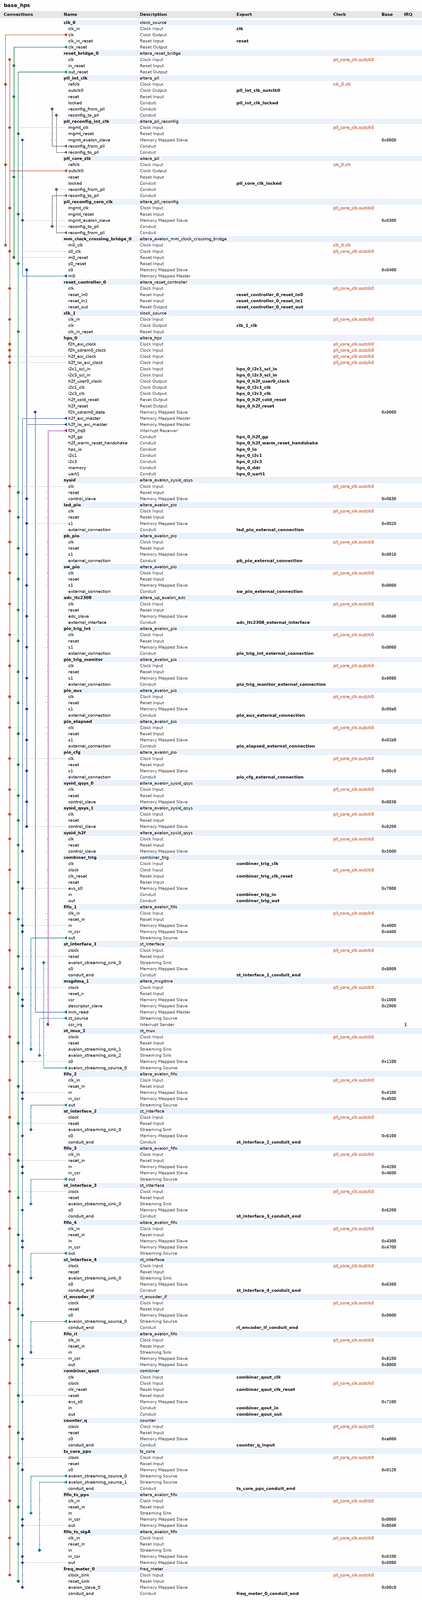
[diagram p0: system contents, whole]
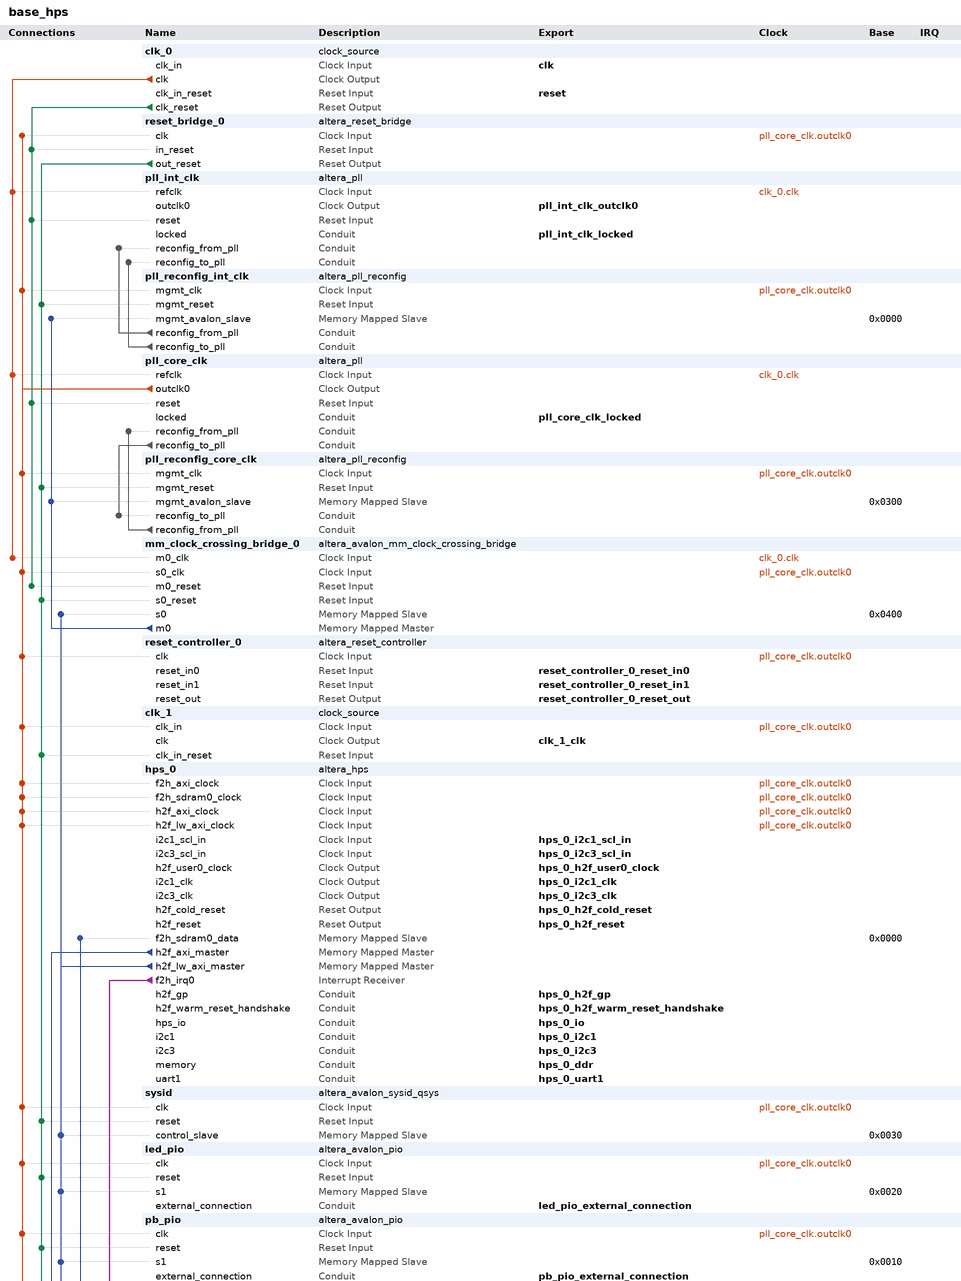
[diagram p1: system contents, upper part]
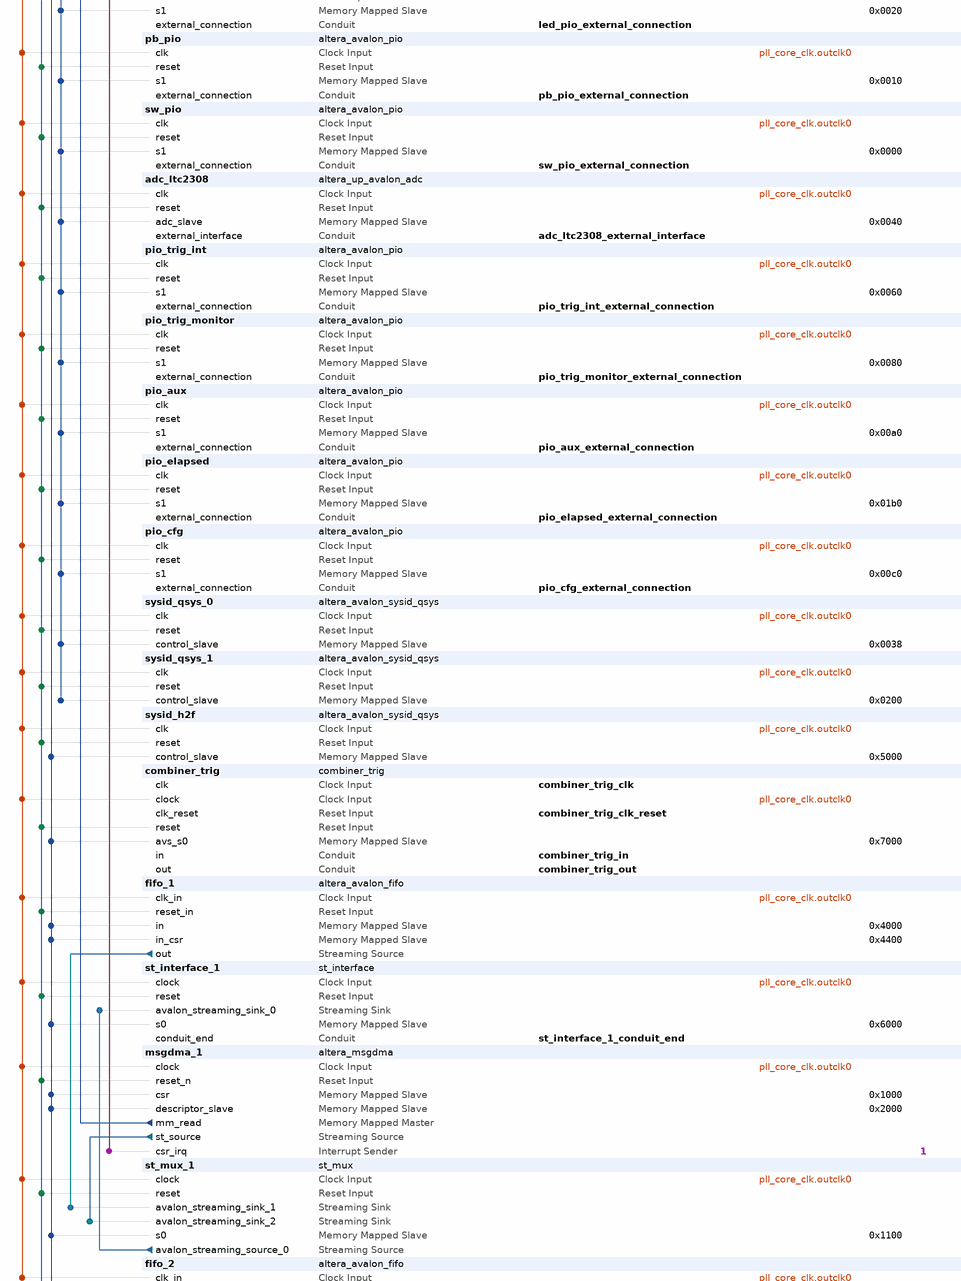
[diagram p2: system contents, middle part]
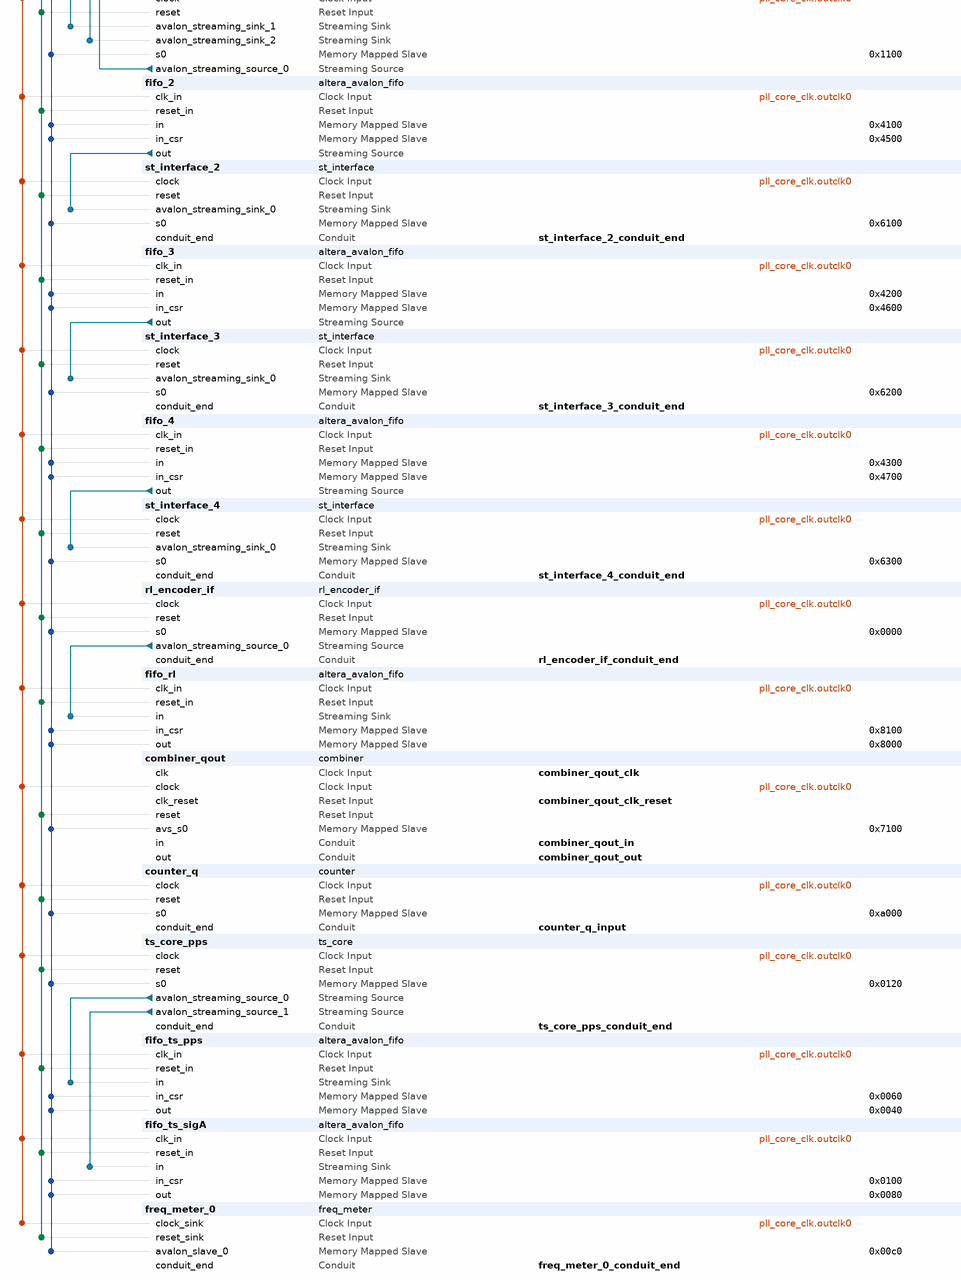
[diagram p3: system contents, lower part]
# Platform Designer (Qsys) system base_hps, Cyclone V 5CSEBA6U23I7
# Parameters at their usual value, and those the tool derives, are not listed.
package require -exact qsys 21.1
create_system base_hps
set_project_property DEVICE_FAMILY {Cyclone V}
set_project_property DEVICE 5CSEBA6U23I7

add_instance clk_0 clock_source 21.1
set_instance_parameter_value clk_0 clockFrequency 50000000

add_instance reset_bridge_0 altera_reset_bridge 21.1
set_instance_parameter_value reset_bridge_0 ACTIVE_LOW_RESET 0
set_instance_parameter_value reset_bridge_0 SYNCHRONOUS_EDGES deassert

add_instance pll_int_clk altera_pll 21.1
set_instance_parameter_value pll_int_clk gui_device_speed_grade 2
set_instance_parameter_value pll_int_clk gui_en_reconf true
set_instance_parameter_value pll_int_clk gui_number_of_clocks 1
set_instance_parameter_value pll_int_clk gui_operation_mode direct
set_instance_parameter_value pll_int_clk gui_output_clock_frequency0 100.0
set_instance_parameter_value pll_int_clk gui_pll_mode {Integer-N PLL}
set_instance_parameter_value pll_int_clk gui_reference_clock_frequency 50.0
set_instance_parameter_value pll_int_clk gui_use_locked true

add_instance pll_reconfig_int_clk altera_pll_reconfig 21.1

add_instance pll_core_clk altera_pll 21.1
set_instance_parameter_value pll_core_clk gui_device_speed_grade 2
set_instance_parameter_value pll_core_clk gui_en_reconf true
set_instance_parameter_value pll_core_clk gui_number_of_clocks 1
set_instance_parameter_value pll_core_clk gui_operation_mode direct
set_instance_parameter_value pll_core_clk gui_output_clock_frequency0 100.0
set_instance_parameter_value pll_core_clk gui_pll_mode {Integer-N PLL}
set_instance_parameter_value pll_core_clk gui_reference_clock_frequency 50.0
set_instance_parameter_value pll_core_clk gui_use_locked true

add_instance pll_reconfig_core_clk altera_pll_reconfig 21.1

add_instance mm_clock_crossing_bridge_0 altera_avalon_mm_clock_crossing_bridge 21.1
set_instance_parameter_value mm_clock_crossing_bridge_0 ADDRESS_WIDTH 10
set_instance_parameter_value mm_clock_crossing_bridge_0 COMMAND_FIFO_DEPTH 4
set_instance_parameter_value mm_clock_crossing_bridge_0 DATA_WIDTH 32
set_instance_parameter_value mm_clock_crossing_bridge_0 MASTER_SYNC_DEPTH 2
set_instance_parameter_value mm_clock_crossing_bridge_0 MAX_BURST_SIZE 1
set_instance_parameter_value mm_clock_crossing_bridge_0 RESPONSE_FIFO_DEPTH 4
set_instance_parameter_value mm_clock_crossing_bridge_0 SLAVE_SYNC_DEPTH 2
set_instance_parameter_value mm_clock_crossing_bridge_0 USE_AUTO_ADDRESS_WIDTH 1

add_instance reset_controller_0 altera_reset_controller 21.1
set_instance_parameter_value reset_controller_0 NUM_RESET_INPUTS 2
set_instance_parameter_value reset_controller_0 SYNC_DEPTH 2

add_instance clk_1 clock_source 21.1
set_instance_parameter_value clk_1 clockFrequency 50000000
set_instance_parameter_value clk_1 clockFrequencyKnown false

add_instance hps_0 altera_hps 21.1
set_instance_parameter_value hps_0 EMAC1_Mode RGMII
set_instance_parameter_value hps_0 EMAC1_PinMuxing {HPS I/O Set 0}
set_instance_parameter_value hps_0 F2SCLK_COLDRST_Enable false
set_instance_parameter_value hps_0 F2SCLK_DBGRST_Enable false
set_instance_parameter_value hps_0 F2SCLK_WARMRST_Enable false
set_instance_parameter_value hps_0 F2SDRAM_Type AXI-3
set_instance_parameter_value hps_0 F2SDRAM_Width 64
set_instance_parameter_value hps_0 F2SINTERRUPT_Enable true
set_instance_parameter_value hps_0 F2S_Width 3
set_instance_parameter_value hps_0 FPGA_PERIPHERAL_OUTPUT_CLOCK_FREQ_EMAC0_GTX_CLK 125
set_instance_parameter_value hps_0 FPGA_PERIPHERAL_OUTPUT_CLOCK_FREQ_EMAC0_MD_CLK 2.5
set_instance_parameter_value hps_0 FPGA_PERIPHERAL_OUTPUT_CLOCK_FREQ_EMAC1_GTX_CLK 125
set_instance_parameter_value hps_0 FPGA_PERIPHERAL_OUTPUT_CLOCK_FREQ_EMAC1_MD_CLK 2.5
set_instance_parameter_value hps_0 GP_Enable true
set_instance_parameter_value hps_0 HPS_PROTOCOL DDR3
set_instance_parameter_value hps_0 I2C0_Mode I2C
set_instance_parameter_value hps_0 I2C0_PinMuxing {HPS I/O Set 0}
set_instance_parameter_value hps_0 I2C1_Mode Full
set_instance_parameter_value hps_0 I2C1_PinMuxing FPGA
set_instance_parameter_value hps_0 I2C3_Mode Full
set_instance_parameter_value hps_0 I2C3_PinMuxing FPGA
set_instance_parameter_value hps_0 LWH2F_Enable true
set_instance_parameter_value hps_0 MEM_BANKADDR_WIDTH 3
set_instance_parameter_value hps_0 MEM_CLK_FREQ 400.0
set_instance_parameter_value hps_0 MEM_COL_ADDR_WIDTH 10
set_instance_parameter_value hps_0 MEM_DQ_WIDTH 32
set_instance_parameter_value hps_0 MEM_DRV_STR RZQ/6
set_instance_parameter_value hps_0 MEM_ROW_ADDR_WIDTH 15
set_instance_parameter_value hps_0 MEM_RTT_NOM RZQ/6
set_instance_parameter_value hps_0 MEM_RTT_WR {Dynamic ODT off}
set_instance_parameter_value hps_0 MEM_TCL 7
set_instance_parameter_value hps_0 MEM_TFAW_NS 45.0
set_instance_parameter_value hps_0 MEM_TRAS_NS 36.0
set_instance_parameter_value hps_0 MEM_TRCD_NS 13.125
set_instance_parameter_value hps_0 MEM_TRFC_NS 300.0
set_instance_parameter_value hps_0 MEM_TRP_NS 13.125
set_instance_parameter_value hps_0 MEM_VENDOR Micron
set_instance_parameter_value hps_0 MEM_WTCL 7
set_instance_parameter_value hps_0 QSPI_Mode N/A
set_instance_parameter_value hps_0 QSPI_PinMuxing Unused
set_instance_parameter_value hps_0 REF_CLK_FREQ 25.0
set_instance_parameter_value hps_0 S2FCLK_COLDRST_Enable true
set_instance_parameter_value hps_0 S2FCLK_PENDINGRST_Enable true
set_instance_parameter_value hps_0 S2FCLK_USER0CLK_Enable true
set_instance_parameter_value hps_0 S2FCLK_USER2CLK 5
set_instance_parameter_value hps_0 S2F_Width 3
set_instance_parameter_value hps_0 SDIO_Mode {4-bit Data}
set_instance_parameter_value hps_0 SDIO_PinMuxing {HPS I/O Set 0}
set_instance_parameter_value hps_0 SPIM1_Mode N/A
set_instance_parameter_value hps_0 SPIM1_PinMuxing Unused
set_instance_parameter_value hps_0 STM_Enable false
set_instance_parameter_value hps_0 TIMING_BOARD_AC_SKEW 0.02
set_instance_parameter_value hps_0 TIMING_BOARD_AC_TO_CK_SKEW 0.01
set_instance_parameter_value hps_0 TIMING_BOARD_DQ_TO_DQS_SKEW 0.05
set_instance_parameter_value hps_0 TIMING_BOARD_MAX_CK_DELAY 0.03
set_instance_parameter_value hps_0 TIMING_BOARD_MAX_DQS_DELAY 0.02
set_instance_parameter_value hps_0 TIMING_BOARD_SKEW_BETWEEN_DQS 0.06
set_instance_parameter_value hps_0 TIMING_BOARD_SKEW_CKDQS_DIMM_MAX 0.12
set_instance_parameter_value hps_0 TIMING_BOARD_SKEW_CKDQS_DIMM_MIN 0.06
set_instance_parameter_value hps_0 TIMING_BOARD_SKEW_WITHIN_DQS 0.01
set_instance_parameter_value hps_0 TIMING_TDH 65
set_instance_parameter_value hps_0 TIMING_TDQSCK 255
set_instance_parameter_value hps_0 TIMING_TDQSQ 125
set_instance_parameter_value hps_0 TIMING_TDS 30
set_instance_parameter_value hps_0 TIMING_TIH 140
set_instance_parameter_value hps_0 TIMING_TIS 190
set_instance_parameter_value hps_0 TIMING_TQSH 0.4
set_instance_parameter_value hps_0 UART0_Mode {No Flow Control}
set_instance_parameter_value hps_0 UART0_PinMuxing {HPS I/O Set 0}
set_instance_parameter_value hps_0 UART1_Mode Full
set_instance_parameter_value hps_0 UART1_PinMuxing FPGA
set_instance_parameter_value hps_0 USB1_Mode SDR
set_instance_parameter_value hps_0 USB1_PinMuxing {HPS I/O Set 0}
set_instance_parameter_value hps_0 desired_cfg_clk_mhz 100.0
set_instance_parameter_value hps_0 desired_qspi_clk_mhz 400.0

add_instance sysid altera_avalon_sysid_qsys 21.1
set_instance_parameter_value sysid id -842982180

add_instance led_pio altera_avalon_pio 21.1
set_instance_parameter_value led_pio direction Output
set_instance_parameter_value led_pio resetValue 85
set_instance_parameter_value led_pio width 8

add_instance pb_pio altera_avalon_pio 21.1
set_instance_parameter_value pb_pio direction Input
set_instance_parameter_value pb_pio width 2

add_instance sw_pio altera_avalon_pio 21.1
set_instance_parameter_value sw_pio direction Input
set_instance_parameter_value sw_pio width 4

add_instance adc_ltc2308 altera_up_avalon_adc 18.0
set_instance_parameter_value adc_ltc2308 board DE10-Nano
set_instance_parameter_value adc_ltc2308 numch_ 8

add_instance pio_trig_int altera_avalon_pio 21.1
set_instance_parameter_value pio_trig_int bitModifyingOutReg true
set_instance_parameter_value pio_trig_int direction Output
set_instance_parameter_value pio_trig_int width 11

add_instance pio_trig_monitor altera_avalon_pio 21.1
set_instance_parameter_value pio_trig_monitor bitClearingEdgeCapReg true
set_instance_parameter_value pio_trig_monitor bitModifyingOutReg true
set_instance_parameter_value pio_trig_monitor direction Input
set_instance_parameter_value pio_trig_monitor width 32

add_instance pio_aux altera_avalon_pio 21.1
set_instance_parameter_value pio_aux bitModifyingOutReg true
set_instance_parameter_value pio_aux direction InOut
set_instance_parameter_value pio_aux width 8

add_instance pio_elapsed altera_avalon_pio 21.1
set_instance_parameter_value pio_elapsed direction Input
set_instance_parameter_value pio_elapsed width 32

add_instance pio_cfg altera_avalon_pio 21.1
set_instance_parameter_value pio_cfg bitModifyingOutReg true
set_instance_parameter_value pio_cfg direction Output
set_instance_parameter_value pio_cfg width 21

add_instance sysid_qsys_0 altera_avalon_sysid_qsys 21.1
set_instance_parameter_value sysid_qsys_0 id 35

add_instance sysid_qsys_1 altera_avalon_sysid_qsys 21.1
set_instance_parameter_value sysid_qsys_1 id 6

add_instance sysid_h2f altera_avalon_sysid_qsys 21.1
set_instance_parameter_value sysid_h2f id 305441741

add_instance combiner_trig combiner_trig 1.0

add_instance fifo_1 altera_avalon_fifo 21.1
set_instance_parameter_value fifo_1 bitsPerSymbol 8
set_instance_parameter_value fifo_1 channelWidth 0
set_instance_parameter_value fifo_1 errorWidth 0
set_instance_parameter_value fifo_1 fifoDepth 1024
set_instance_parameter_value fifo_1 fifoInputInterfaceOptions AVALONMM_WRITE
set_instance_parameter_value fifo_1 fifoOutputInterfaceOptions AVALONST_SOURCE
set_instance_parameter_value fifo_1 singleClockMode true
set_instance_parameter_value fifo_1 symbolsPerBeat 4
set_instance_parameter_value fifo_1 useIRQ false
set_instance_parameter_value fifo_1 usePacket false
set_instance_parameter_value fifo_1 useReadControl false

add_instance st_interface_1 st_interface 1.0

add_instance msgdma_1 altera_msgdma 21.1
set_instance_parameter_value msgdma_1 BURST_ENABLE 1
set_instance_parameter_value msgdma_1 BURST_WRAPPING_SUPPORT 1
set_instance_parameter_value msgdma_1 DATA_FIFO_DEPTH 1024
set_instance_parameter_value msgdma_1 DATA_WIDTH 32
set_instance_parameter_value msgdma_1 DESCRIPTOR_FIFO_DEPTH 32
set_instance_parameter_value msgdma_1 ENHANCED_FEATURES 0
set_instance_parameter_value msgdma_1 ERROR_ENABLE 0
set_instance_parameter_value msgdma_1 MAX_BURST_COUNT 256
set_instance_parameter_value msgdma_1 MAX_BYTE 536870912
set_instance_parameter_value msgdma_1 MODE 1
set_instance_parameter_value msgdma_1 PACKET_ENABLE 0
set_instance_parameter_value msgdma_1 TRANSFER_TYPE {Full Word Accesses Only}
set_instance_parameter_value msgdma_1 USE_FIX_ADDRESS_WIDTH 1

add_instance st_mux_1 st_mux 1.0

add_instance fifo_2 altera_avalon_fifo 21.1
set_instance_parameter_value fifo_2 bitsPerSymbol 8
set_instance_parameter_value fifo_2 channelWidth 0
set_instance_parameter_value fifo_2 errorWidth 0
set_instance_parameter_value fifo_2 fifoDepth 1024
set_instance_parameter_value fifo_2 fifoInputInterfaceOptions AVALONMM_WRITE
set_instance_parameter_value fifo_2 fifoOutputInterfaceOptions AVALONST_SOURCE
set_instance_parameter_value fifo_2 singleClockMode true
set_instance_parameter_value fifo_2 symbolsPerBeat 4
set_instance_parameter_value fifo_2 useIRQ false
set_instance_parameter_value fifo_2 usePacket false
set_instance_parameter_value fifo_2 useReadControl false

add_instance st_interface_2 st_interface 1.0

add_instance fifo_3 altera_avalon_fifo 21.1
set_instance_parameter_value fifo_3 bitsPerSymbol 8
set_instance_parameter_value fifo_3 channelWidth 0
set_instance_parameter_value fifo_3 errorWidth 0
set_instance_parameter_value fifo_3 fifoDepth 1024
set_instance_parameter_value fifo_3 fifoInputInterfaceOptions AVALONMM_WRITE
set_instance_parameter_value fifo_3 fifoOutputInterfaceOptions AVALONST_SOURCE
set_instance_parameter_value fifo_3 singleClockMode true
set_instance_parameter_value fifo_3 symbolsPerBeat 4
set_instance_parameter_value fifo_3 useIRQ false
set_instance_parameter_value fifo_3 usePacket false
set_instance_parameter_value fifo_3 useReadControl false

add_instance st_interface_3 st_interface 1.0

add_instance fifo_4 altera_avalon_fifo 21.1
set_instance_parameter_value fifo_4 bitsPerSymbol 8
set_instance_parameter_value fifo_4 channelWidth 0
set_instance_parameter_value fifo_4 errorWidth 0
set_instance_parameter_value fifo_4 fifoDepth 1024
set_instance_parameter_value fifo_4 fifoInputInterfaceOptions AVALONMM_WRITE
set_instance_parameter_value fifo_4 fifoOutputInterfaceOptions AVALONST_SOURCE
set_instance_parameter_value fifo_4 singleClockMode true
set_instance_parameter_value fifo_4 symbolsPerBeat 4
set_instance_parameter_value fifo_4 useIRQ false
set_instance_parameter_value fifo_4 usePacket false
set_instance_parameter_value fifo_4 useReadControl false

add_instance st_interface_4 st_interface 1.0

add_instance rl_encoder_if rl_encoder_if 1.0

add_instance fifo_rl altera_avalon_fifo 21.1
set_instance_parameter_value fifo_rl bitsPerSymbol 32
set_instance_parameter_value fifo_rl channelWidth 0
set_instance_parameter_value fifo_rl errorWidth 0
set_instance_parameter_value fifo_rl fifoDepth 1024
set_instance_parameter_value fifo_rl fifoInputInterfaceOptions AVALONST_SINK
set_instance_parameter_value fifo_rl fifoOutputInterfaceOptions AVALONMM_READ
set_instance_parameter_value fifo_rl singleClockMode true
set_instance_parameter_value fifo_rl symbolsPerBeat 1
set_instance_parameter_value fifo_rl useIRQ false
set_instance_parameter_value fifo_rl usePacket false
set_instance_parameter_value fifo_rl useReadControl false

add_instance combiner_qout combiner 1.0

add_instance counter_q counter 1.0
set_instance_parameter_value counter_q width_addr 8
set_instance_parameter_value counter_q width_bus 32
set_instance_parameter_value counter_q width_data 32

add_instance ts_core_pps ts_core 1.0
set_instance_parameter_value ts_core_pps CTR_W 64

add_instance fifo_ts_pps altera_avalon_fifo 21.1
set_instance_parameter_value fifo_ts_pps bitsPerSymbol 32
set_instance_parameter_value fifo_ts_pps channelWidth 0
set_instance_parameter_value fifo_ts_pps errorWidth 0
set_instance_parameter_value fifo_ts_pps fifoDepth 16
set_instance_parameter_value fifo_ts_pps fifoInputInterfaceOptions AVALONST_SINK
set_instance_parameter_value fifo_ts_pps fifoOutputInterfaceOptions AVALONMM_READ
set_instance_parameter_value fifo_ts_pps singleClockMode true
set_instance_parameter_value fifo_ts_pps symbolsPerBeat 1
set_instance_parameter_value fifo_ts_pps useIRQ false
set_instance_parameter_value fifo_ts_pps usePacket false
set_instance_parameter_value fifo_ts_pps useReadControl false

add_instance fifo_ts_sigA altera_avalon_fifo 21.1
set_instance_parameter_value fifo_ts_sigA bitsPerSymbol 32
set_instance_parameter_value fifo_ts_sigA channelWidth 0
set_instance_parameter_value fifo_ts_sigA errorWidth 0
set_instance_parameter_value fifo_ts_sigA fifoDepth 16
set_instance_parameter_value fifo_ts_sigA fifoInputInterfaceOptions AVALONST_SINK
set_instance_parameter_value fifo_ts_sigA fifoOutputInterfaceOptions AVALONMM_READ
set_instance_parameter_value fifo_ts_sigA singleClockMode true
set_instance_parameter_value fifo_ts_sigA symbolsPerBeat 1
set_instance_parameter_value fifo_ts_sigA useIRQ false
set_instance_parameter_value fifo_ts_sigA usePacket false
set_instance_parameter_value fifo_ts_sigA useReadControl false

add_instance freq_meter_0 freq_meter 1.0

# connections
add_connection clk_0.clk mm_clock_crossing_bridge_0.m0_clk clock
add_connection clk_0.clk pll_core_clk.refclk clock
add_connection clk_0.clk pll_int_clk.refclk clock
add_connection pll_core_clk.outclk0 adc_ltc2308.clk clock
add_connection pll_core_clk.outclk0 clk_1.clk_in clock
add_connection pll_core_clk.outclk0 combiner_qout.clock clock
add_connection pll_core_clk.outclk0 combiner_trig.clock clock
add_connection pll_core_clk.outclk0 counter_q.clock clock
add_connection pll_core_clk.outclk0 fifo_1.clk_in clock
add_connection pll_core_clk.outclk0 fifo_2.clk_in clock
add_connection pll_core_clk.outclk0 fifo_3.clk_in clock
add_connection pll_core_clk.outclk0 fifo_4.clk_in clock
add_connection pll_core_clk.outclk0 fifo_rl.clk_in clock
add_connection pll_core_clk.outclk0 fifo_ts_pps.clk_in clock
add_connection pll_core_clk.outclk0 fifo_ts_sigA.clk_in clock
add_connection pll_core_clk.outclk0 freq_meter_0.clock_sink clock
add_connection pll_core_clk.outclk0 hps_0.f2h_axi_clock clock
add_connection pll_core_clk.outclk0 hps_0.f2h_sdram0_clock clock
add_connection pll_core_clk.outclk0 hps_0.h2f_axi_clock clock
add_connection pll_core_clk.outclk0 hps_0.h2f_lw_axi_clock clock
add_connection pll_core_clk.outclk0 led_pio.clk clock
add_connection pll_core_clk.outclk0 mm_clock_crossing_bridge_0.s0_clk clock
add_connection pll_core_clk.outclk0 msgdma_1.clock clock
add_connection pll_core_clk.outclk0 pb_pio.clk clock
add_connection pll_core_clk.outclk0 pio_aux.clk clock
add_connection pll_core_clk.outclk0 pio_cfg.clk clock
add_connection pll_core_clk.outclk0 pio_elapsed.clk clock
add_connection pll_core_clk.outclk0 pio_trig_int.clk clock
add_connection pll_core_clk.outclk0 pio_trig_monitor.clk clock
add_connection pll_core_clk.outclk0 pll_reconfig_core_clk.mgmt_clk clock
add_connection pll_core_clk.outclk0 pll_reconfig_int_clk.mgmt_clk clock
add_connection pll_core_clk.outclk0 reset_bridge_0.clk clock
add_connection pll_core_clk.outclk0 reset_controller_0.clk clock
add_connection pll_core_clk.outclk0 rl_encoder_if.clock clock
add_connection pll_core_clk.outclk0 st_interface_1.clock clock
add_connection pll_core_clk.outclk0 st_interface_2.clock clock
add_connection pll_core_clk.outclk0 st_interface_3.clock clock
add_connection pll_core_clk.outclk0 st_interface_4.clock clock
add_connection pll_core_clk.outclk0 st_mux_1.clock clock
add_connection pll_core_clk.outclk0 sw_pio.clk clock
add_connection pll_core_clk.outclk0 sysid.clk clock
add_connection pll_core_clk.outclk0 sysid_h2f.clk clock
add_connection pll_core_clk.outclk0 sysid_qsys_0.clk clock
add_connection pll_core_clk.outclk0 sysid_qsys_1.clk clock
add_connection pll_core_clk.outclk0 ts_core_pps.clock clock
add_connection clk_0.clk_reset mm_clock_crossing_bridge_0.m0_reset reset
add_connection clk_0.clk_reset pll_core_clk.reset reset
add_connection clk_0.clk_reset pll_int_clk.reset reset
add_connection clk_0.clk_reset reset_bridge_0.in_reset reset
add_connection reset_bridge_0.out_reset adc_ltc2308.reset reset
add_connection reset_bridge_0.out_reset clk_1.clk_in_reset reset
add_connection reset_bridge_0.out_reset combiner_qout.reset reset
add_connection reset_bridge_0.out_reset combiner_trig.reset reset
add_connection reset_bridge_0.out_reset counter_q.reset reset
add_connection reset_bridge_0.out_reset fifo_1.reset_in reset
add_connection reset_bridge_0.out_reset fifo_2.reset_in reset
add_connection reset_bridge_0.out_reset fifo_3.reset_in reset
add_connection reset_bridge_0.out_reset fifo_4.reset_in reset
add_connection reset_bridge_0.out_reset fifo_rl.reset_in reset
add_connection reset_bridge_0.out_reset fifo_ts_pps.reset_in reset
add_connection reset_bridge_0.out_reset fifo_ts_sigA.reset_in reset
add_connection reset_bridge_0.out_reset freq_meter_0.reset_sink reset
add_connection reset_bridge_0.out_reset led_pio.reset reset
add_connection reset_bridge_0.out_reset mm_clock_crossing_bridge_0.s0_reset reset
add_connection reset_bridge_0.out_reset msgdma_1.reset_n reset
add_connection reset_bridge_0.out_reset pb_pio.reset reset
add_connection reset_bridge_0.out_reset pio_aux.reset reset
add_connection reset_bridge_0.out_reset pio_cfg.reset reset
add_connection reset_bridge_0.out_reset pio_elapsed.reset reset
add_connection reset_bridge_0.out_reset pio_trig_int.reset reset
add_connection reset_bridge_0.out_reset pio_trig_monitor.reset reset
add_connection reset_bridge_0.out_reset pll_reconfig_core_clk.mgmt_reset reset
add_connection reset_bridge_0.out_reset pll_reconfig_int_clk.mgmt_reset reset
add_connection reset_bridge_0.out_reset rl_encoder_if.reset reset
add_connection reset_bridge_0.out_reset st_interface_1.reset reset
add_connection reset_bridge_0.out_reset st_interface_2.reset reset
add_connection reset_bridge_0.out_reset st_interface_3.reset reset
add_connection reset_bridge_0.out_reset st_interface_4.reset reset
add_connection reset_bridge_0.out_reset st_mux_1.reset reset
add_connection reset_bridge_0.out_reset sw_pio.reset reset
add_connection reset_bridge_0.out_reset sysid.reset reset
add_connection reset_bridge_0.out_reset sysid_h2f.reset reset
add_connection reset_bridge_0.out_reset sysid_qsys_0.reset reset
add_connection reset_bridge_0.out_reset sysid_qsys_1.reset reset
add_connection reset_bridge_0.out_reset ts_core_pps.reset reset
add_connection hps_0.h2f_axi_master combiner_qout.avs_s0 avalon
set_connection_parameter_value hps_0.h2f_axi_master/combiner_qout.avs_s0 baseAddress 0x7100
add_connection hps_0.h2f_axi_master combiner_trig.avs_s0 avalon
set_connection_parameter_value hps_0.h2f_axi_master/combiner_trig.avs_s0 baseAddress 0x7000
add_connection hps_0.h2f_axi_master counter_q.s0 avalon
set_connection_parameter_value hps_0.h2f_axi_master/counter_q.s0 baseAddress 0xa000
add_connection hps_0.h2f_axi_master fifo_1.in avalon
set_connection_parameter_value hps_0.h2f_axi_master/fifo_1.in baseAddress 0x4000
add_connection hps_0.h2f_axi_master fifo_1.in_csr avalon
set_connection_parameter_value hps_0.h2f_axi_master/fifo_1.in_csr baseAddress 0x4400
add_connection hps_0.h2f_axi_master fifo_2.in avalon
set_connection_parameter_value hps_0.h2f_axi_master/fifo_2.in baseAddress 0x4100
add_connection hps_0.h2f_axi_master fifo_2.in_csr avalon
set_connection_parameter_value hps_0.h2f_axi_master/fifo_2.in_csr baseAddress 0x4500
add_connection hps_0.h2f_axi_master fifo_3.in avalon
set_connection_parameter_value hps_0.h2f_axi_master/fifo_3.in baseAddress 0x4200
add_connection hps_0.h2f_axi_master fifo_3.in_csr avalon
set_connection_parameter_value hps_0.h2f_axi_master/fifo_3.in_csr baseAddress 0x4600
add_connection hps_0.h2f_axi_master fifo_4.in avalon
set_connection_parameter_value hps_0.h2f_axi_master/fifo_4.in baseAddress 0x4300
add_connection hps_0.h2f_axi_master fifo_4.in_csr avalon
set_connection_parameter_value hps_0.h2f_axi_master/fifo_4.in_csr baseAddress 0x4700
add_connection hps_0.h2f_axi_master fifo_rl.in_csr avalon
set_connection_parameter_value hps_0.h2f_axi_master/fifo_rl.in_csr baseAddress 0x8100
add_connection hps_0.h2f_axi_master fifo_rl.out avalon
set_connection_parameter_value hps_0.h2f_axi_master/fifo_rl.out baseAddress 0x8000
add_connection hps_0.h2f_axi_master fifo_ts_pps.in_csr avalon
set_connection_parameter_value hps_0.h2f_axi_master/fifo_ts_pps.in_csr baseAddress 0x0060
add_connection hps_0.h2f_axi_master fifo_ts_pps.out avalon
set_connection_parameter_value hps_0.h2f_axi_master/fifo_ts_pps.out baseAddress 0x0040
add_connection hps_0.h2f_axi_master fifo_ts_sigA.in_csr avalon
set_connection_parameter_value hps_0.h2f_axi_master/fifo_ts_sigA.in_csr baseAddress 0x0100
add_connection hps_0.h2f_axi_master fifo_ts_sigA.out avalon
set_connection_parameter_value hps_0.h2f_axi_master/fifo_ts_sigA.out baseAddress 0x0080
add_connection hps_0.h2f_axi_master freq_meter_0.avalon_slave_0 avalon
set_connection_parameter_value hps_0.h2f_axi_master/freq_meter_0.avalon_slave_0 baseAddress 0x00c0
add_connection hps_0.h2f_axi_master msgdma_1.csr avalon
set_connection_parameter_value hps_0.h2f_axi_master/msgdma_1.csr baseAddress 0x1000
add_connection hps_0.h2f_axi_master msgdma_1.descriptor_slave avalon
set_connection_parameter_value hps_0.h2f_axi_master/msgdma_1.descriptor_slave baseAddress 0x2000
add_connection hps_0.h2f_axi_master rl_encoder_if.s0 avalon
set_connection_parameter_value hps_0.h2f_axi_master/rl_encoder_if.s0 baseAddress 0x0000
add_connection hps_0.h2f_axi_master st_interface_1.s0 avalon
set_connection_parameter_value hps_0.h2f_axi_master/st_interface_1.s0 baseAddress 0x6000
add_connection hps_0.h2f_axi_master st_interface_2.s0 avalon
set_connection_parameter_value hps_0.h2f_axi_master/st_interface_2.s0 baseAddress 0x6100
add_connection hps_0.h2f_axi_master st_interface_3.s0 avalon
set_connection_parameter_value hps_0.h2f_axi_master/st_interface_3.s0 baseAddress 0x6200
add_connection hps_0.h2f_axi_master st_interface_4.s0 avalon
set_connection_parameter_value hps_0.h2f_axi_master/st_interface_4.s0 baseAddress 0x6300
add_connection hps_0.h2f_axi_master st_mux_1.s0 avalon
set_connection_parameter_value hps_0.h2f_axi_master/st_mux_1.s0 baseAddress 0x1100
add_connection hps_0.h2f_axi_master sysid_h2f.control_slave avalon
set_connection_parameter_value hps_0.h2f_axi_master/sysid_h2f.control_slave baseAddress 0x5000
add_connection hps_0.h2f_axi_master ts_core_pps.s0 avalon
set_connection_parameter_value hps_0.h2f_axi_master/ts_core_pps.s0 baseAddress 0x0120
add_connection hps_0.h2f_lw_axi_master adc_ltc2308.adc_slave avalon
set_connection_parameter_value hps_0.h2f_lw_axi_master/adc_ltc2308.adc_slave baseAddress 0x0040
add_connection hps_0.h2f_lw_axi_master led_pio.s1 avalon
set_connection_parameter_value hps_0.h2f_lw_axi_master/led_pio.s1 baseAddress 0x0020
add_connection hps_0.h2f_lw_axi_master mm_clock_crossing_bridge_0.s0 avalon
set_connection_parameter_value hps_0.h2f_lw_axi_master/mm_clock_crossing_bridge_0.s0 baseAddress 0x0400
add_connection hps_0.h2f_lw_axi_master pb_pio.s1 avalon
set_connection_parameter_value hps_0.h2f_lw_axi_master/pb_pio.s1 baseAddress 0x0010
add_connection hps_0.h2f_lw_axi_master pio_aux.s1 avalon
set_connection_parameter_value hps_0.h2f_lw_axi_master/pio_aux.s1 baseAddress 0x00a0
add_connection hps_0.h2f_lw_axi_master pio_cfg.s1 avalon
set_connection_parameter_value hps_0.h2f_lw_axi_master/pio_cfg.s1 baseAddress 0x00c0
add_connection hps_0.h2f_lw_axi_master pio_elapsed.s1 avalon
set_connection_parameter_value hps_0.h2f_lw_axi_master/pio_elapsed.s1 baseAddress 0x01b0
add_connection hps_0.h2f_lw_axi_master pio_trig_int.s1 avalon
set_connection_parameter_value hps_0.h2f_lw_axi_master/pio_trig_int.s1 baseAddress 0x0060
add_connection hps_0.h2f_lw_axi_master pio_trig_monitor.s1 avalon
set_connection_parameter_value hps_0.h2f_lw_axi_master/pio_trig_monitor.s1 baseAddress 0x0080
add_connection hps_0.h2f_lw_axi_master sw_pio.s1 avalon
set_connection_parameter_value hps_0.h2f_lw_axi_master/sw_pio.s1 baseAddress 0x0000
add_connection hps_0.h2f_lw_axi_master sysid.control_slave avalon
set_connection_parameter_value hps_0.h2f_lw_axi_master/sysid.control_slave baseAddress 0x0030
add_connection hps_0.h2f_lw_axi_master sysid_qsys_0.control_slave avalon
set_connection_parameter_value hps_0.h2f_lw_axi_master/sysid_qsys_0.control_slave baseAddress 0x0038
add_connection hps_0.h2f_lw_axi_master sysid_qsys_1.control_slave avalon
set_connection_parameter_value hps_0.h2f_lw_axi_master/sysid_qsys_1.control_slave baseAddress 0x0200
add_connection mm_clock_crossing_bridge_0.m0 pll_reconfig_core_clk.mgmt_avalon_slave avalon
set_connection_parameter_value mm_clock_crossing_bridge_0.m0/pll_reconfig_core_clk.mgmt_avalon_slave baseAddress 0x0300
add_connection mm_clock_crossing_bridge_0.m0 pll_reconfig_int_clk.mgmt_avalon_slave avalon
set_connection_parameter_value mm_clock_crossing_bridge_0.m0/pll_reconfig_int_clk.mgmt_avalon_slave baseAddress 0x0000
add_connection msgdma_1.mm_read hps_0.f2h_sdram0_data avalon
set_connection_parameter_value msgdma_1.mm_read/hps_0.f2h_sdram0_data baseAddress 0x0000
add_connection fifo_1.out st_mux_1.avalon_streaming_sink_1 avalon_streaming
add_connection fifo_2.out st_interface_2.avalon_streaming_sink_0 avalon_streaming
add_connection fifo_3.out st_interface_3.avalon_streaming_sink_0 avalon_streaming
add_connection fifo_4.out st_interface_4.avalon_streaming_sink_0 avalon_streaming
add_connection msgdma_1.st_source st_mux_1.avalon_streaming_sink_2 avalon_streaming
add_connection rl_encoder_if.avalon_streaming_source_0 fifo_rl.in avalon_streaming
add_connection st_mux_1.avalon_streaming_source_0 st_interface_1.avalon_streaming_sink_0 avalon_streaming
add_connection ts_core_pps.avalon_streaming_source_0 fifo_ts_pps.in avalon_streaming
add_connection ts_core_pps.avalon_streaming_source_1 fifo_ts_sigA.in avalon_streaming
add_connection pll_core_clk.reconfig_to_pll pll_reconfig_core_clk.reconfig_to_pll conduit
add_connection pll_reconfig_core_clk.reconfig_from_pll pll_core_clk.reconfig_from_pll conduit
add_connection pll_reconfig_int_clk.reconfig_from_pll pll_int_clk.reconfig_from_pll conduit
add_connection pll_reconfig_int_clk.reconfig_to_pll pll_int_clk.reconfig_to_pll conduit
add_connection hps_0.f2h_irq0 msgdma_1.csr_irq interrupt
set_connection_parameter_value hps_0.f2h_irq0/msgdma_1.csr_irq irqNumber 1

# exported interfaces
add_interface adc_ltc2308_external_interface conduit end
set_interface_property adc_ltc2308_external_interface EXPORT_OF adc_ltc2308.external_interface
add_interface clk clock sink
set_interface_property clk EXPORT_OF clk_0.clk_in
add_interface clk_1_clk clock source
set_interface_property clk_1_clk EXPORT_OF clk_1.clk
add_interface combiner_qout_clk clock sink
set_interface_property combiner_qout_clk EXPORT_OF combiner_qout.clk
add_interface combiner_qout_clk_reset reset sink
set_interface_property combiner_qout_clk_reset EXPORT_OF combiner_qout.clk_reset
add_interface combiner_qout_in conduit end
set_interface_property combiner_qout_in EXPORT_OF combiner_qout.in
add_interface combiner_qout_out conduit end
set_interface_property combiner_qout_out EXPORT_OF combiner_qout.out
add_interface combiner_trig_clk clock sink
set_interface_property combiner_trig_clk EXPORT_OF combiner_trig.clk
add_interface combiner_trig_clk_reset reset sink
set_interface_property combiner_trig_clk_reset EXPORT_OF combiner_trig.clk_reset
add_interface combiner_trig_in conduit end
set_interface_property combiner_trig_in EXPORT_OF combiner_trig.in
add_interface combiner_trig_out conduit end
set_interface_property combiner_trig_out EXPORT_OF combiner_trig.out
add_interface counter_q_input conduit end
set_interface_property counter_q_input EXPORT_OF counter_q.conduit_end
add_interface freq_meter_0_conduit_end conduit end
set_interface_property freq_meter_0_conduit_end EXPORT_OF freq_meter_0.conduit_end
add_interface hps_0_ddr conduit end
set_interface_property hps_0_ddr EXPORT_OF hps_0.memory
add_interface hps_0_h2f_cold_reset reset source
set_interface_property hps_0_h2f_cold_reset EXPORT_OF hps_0.h2f_cold_reset
add_interface hps_0_h2f_gp conduit end
set_interface_property hps_0_h2f_gp EXPORT_OF hps_0.h2f_gp
add_interface hps_0_h2f_reset reset source
set_interface_property hps_0_h2f_reset EXPORT_OF hps_0.h2f_reset
add_interface hps_0_h2f_user0_clock clock source
set_interface_property hps_0_h2f_user0_clock EXPORT_OF hps_0.h2f_user0_clock
add_interface hps_0_h2f_warm_reset_handshake conduit end
set_interface_property hps_0_h2f_warm_reset_handshake EXPORT_OF hps_0.h2f_warm_reset_handshake
add_interface hps_0_i2c1 conduit end
set_interface_property hps_0_i2c1 EXPORT_OF hps_0.i2c1
add_interface hps_0_i2c1_clk clock source
set_interface_property hps_0_i2c1_clk EXPORT_OF hps_0.i2c1_clk
add_interface hps_0_i2c1_scl_in clock sink
set_interface_property hps_0_i2c1_scl_in EXPORT_OF hps_0.i2c1_scl_in
add_interface hps_0_i2c3 conduit end
set_interface_property hps_0_i2c3 EXPORT_OF hps_0.i2c3
add_interface hps_0_i2c3_clk clock source
set_interface_property hps_0_i2c3_clk EXPORT_OF hps_0.i2c3_clk
add_interface hps_0_i2c3_scl_in clock sink
set_interface_property hps_0_i2c3_scl_in EXPORT_OF hps_0.i2c3_scl_in
add_interface hps_0_io conduit end
set_interface_property hps_0_io EXPORT_OF hps_0.hps_io
add_interface hps_0_uart1 conduit end
set_interface_property hps_0_uart1 EXPORT_OF hps_0.uart1
add_interface led_pio_external_connection conduit end
set_interface_property led_pio_external_connection EXPORT_OF led_pio.external_connection
add_interface pb_pio_external_connection conduit end
set_interface_property pb_pio_external_connection EXPORT_OF pb_pio.external_connection
add_interface pio_aux_external_connection conduit end
set_interface_property pio_aux_external_connection EXPORT_OF pio_aux.external_connection
add_interface pio_cfg_external_connection conduit end
set_interface_property pio_cfg_external_connection EXPORT_OF pio_cfg.external_connection
add_interface pio_elapsed_external_connection conduit end
set_interface_property pio_elapsed_external_connection EXPORT_OF pio_elapsed.external_connection
add_interface pio_trig_int_external_connection conduit end
set_interface_property pio_trig_int_external_connection EXPORT_OF pio_trig_int.external_connection
add_interface pio_trig_monitor_external_connection conduit end
set_interface_property pio_trig_monitor_external_connection EXPORT_OF pio_trig_monitor.external_connection
add_interface pll_core_clk_locked conduit end
set_interface_property pll_core_clk_locked EXPORT_OF pll_core_clk.locked
add_interface pll_int_clk_locked conduit end
set_interface_property pll_int_clk_locked EXPORT_OF pll_int_clk.locked
add_interface pll_int_clk_outclk0 clock source
set_interface_property pll_int_clk_outclk0 EXPORT_OF pll_int_clk.outclk0
add_interface reset reset sink
set_interface_property reset EXPORT_OF clk_0.clk_in_reset
add_interface reset_controller_0_reset_in0 reset sink
set_interface_property reset_controller_0_reset_in0 EXPORT_OF reset_controller_0.reset_in0
add_interface reset_controller_0_reset_in1 reset sink
set_interface_property reset_controller_0_reset_in1 EXPORT_OF reset_controller_0.reset_in1
add_interface reset_controller_0_reset_out reset source
set_interface_property reset_controller_0_reset_out EXPORT_OF reset_controller_0.reset_out
add_interface rl_encoder_if_conduit_end conduit end
set_interface_property rl_encoder_if_conduit_end EXPORT_OF rl_encoder_if.conduit_end
add_interface st_interface_1_conduit_end conduit end
set_interface_property st_interface_1_conduit_end EXPORT_OF st_interface_1.conduit_end
add_interface st_interface_2_conduit_end conduit end
set_interface_property st_interface_2_conduit_end EXPORT_OF st_interface_2.conduit_end
add_interface st_interface_3_conduit_end conduit end
set_interface_property st_interface_3_conduit_end EXPORT_OF st_interface_3.conduit_end
add_interface st_interface_4_conduit_end conduit end
set_interface_property st_interface_4_conduit_end EXPORT_OF st_interface_4.conduit_end
add_interface sw_pio_external_connection conduit end
set_interface_property sw_pio_external_connection EXPORT_OF sw_pio.external_connection
add_interface ts_core_pps_conduit_end conduit end
set_interface_property ts_core_pps_conduit_end EXPORT_OF ts_core_pps.conduit_end

set_interconnect_requirement {$system} qsys_mm.clockCrossingAdapter HANDSHAKE
set_interconnect_requirement {$system} qsys_mm.enableEccProtection FALSE
set_interconnect_requirement {$system} qsys_mm.insertDefaultSlave FALSE
set_interconnect_requirement {$system} qsys_mm.maxAdditionalLatency 3

save_system base_hps.qsys
